# EAGLE design dual.seq.v1.0.0.main (EAGLE 7.7.0)
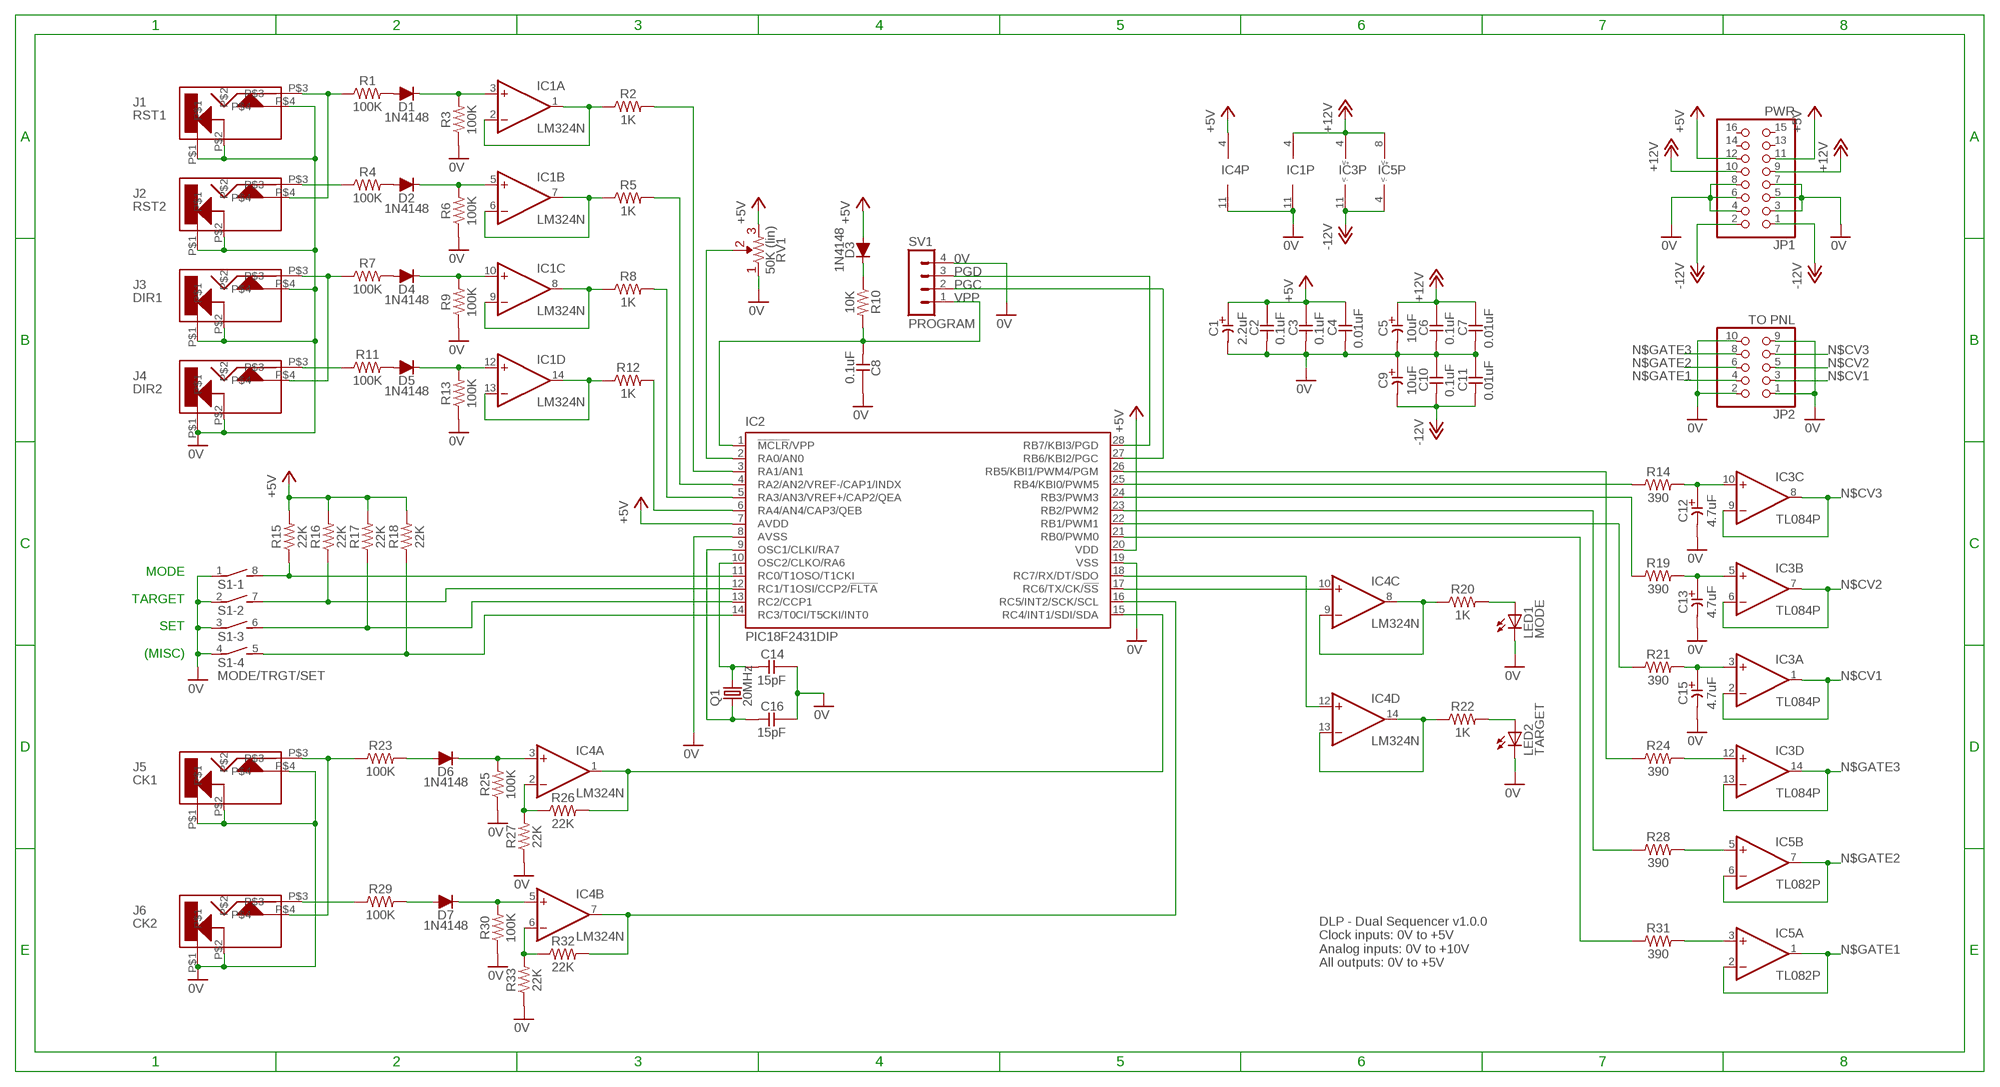
[diagram p0: schematic, sheet 1]

## Parts
C1  2.2uF  CE-USE2-5  [E2-5]
C2  0.1uF  CC-US025-024X044  [C025-024X044]
C3  0.1uF  CC-US025-024X044  [C025-024X044]
C4  0.01uF  CC-US025-024X044  [C025-024X044]
C5  10uF  CE-USE2-5  [E2-5]
C6  0.1uF  CC-US025-024X044  [C025-024X044]
C7  0.01uF  CC-US025-024X044  [C025-024X044]
C8  0.1uF  CC-US025-024X044  [C025-024X044]
C9  10uF  CE-USE2-5  [E2-5]
C10  0.1uF  CC-US025-024X044  [C025-024X044]
C11  0.01uF  CC-US025-024X044  [C025-024X044]
C12  4.7uF  CE-USE2-5  [E2-5]
C13  4.7uF  CE-USE2-5  [E2-5]
C14  15pF  CC-US025-024X044  [C025-024X044]
C15  4.7uF  CE-USE2-5  [E2-5]
C16  15pF  CC-US025-024X044  [C025-024X044]
D1  1N4148  [DO34-5]
D2  1N4148  [DO34-5]
D3  1N4148  [DO34-5]
D4  1N4148  [DO34-5]
D5  1N4148  [DO34-5]
D6  1N4148  [DO34-5]
D7  1N4148  [DO34-5]
IC1  LM324N  [DIL14]
IC2  PIC18F2431DIP  [DIL28-3]
IC3  TL084P  [DIL14]
IC4  LM324N  [DIL14]
IC5  TL082P  [DIL08]
J1  RST1  CL1384  [CL1384]
J2  RST2  CL1384  [CL1384]
J3  DIR1  CL1384  [CL1384]
J4  DIR2  CL1384  [CL1384]
J5  CK1  CL1384  [CL1384]
J6  CK2  CL1384  [CL1384]
JP1  PWR  PINHD-2X8  [2X08]
JP2  TO PNL  PINHD-2X5  [2X05]
LED1  MODE  LED3MM  [LED3MM]
LED2  TARGET  LED3MM  [LED3MM]
Q1  20MHz  CRYSTALHC49S  [HC49/S]
R1  100K  R  [0207/7]
R2  1K  R  [0207/7]
R3  100K  R  [0207/7]
R4  100K  R  [0207/7]
R5  1K  R  [0207/7]
R6  100K  R  [0207/7]
R7  100K  R  [0207/7]
R8  1K  R  [0207/7]
R9  100K  R  [0207/7]
R10  10K  R  [0207/7]
R11  100K  R  [0207/7]
R12  1K  R  [0207/7]
R13  100K  R  [0207/7]
R14  390  R  [0207/7]
R15  22K  R  [0207/7]
R16  22K  R  [0207/7]
R17  22K  R  [0207/7]
R18  22K  R  [0207/7]
R19  390  R  [0207/7]
R20  1K  R  [0207/7]
R21  390  R  [0207/7]
R22  1K  R  [0207/7]
R23  100K  R  [0207/7]
R24  390  R  [0207/7]
R25  100K  R  [0207/7]
R26  22K  R  [0207/7]
R27  22K  R  [0207/7]
R28  390  R  [0207/7]
R29  100K  R  [0207/7]
R30  100K  R  [0207/7]
R31  390  R  [0207/7]
R32  22K  R  [0207/7]
R33  22K  R  [0207/7]
RV1  50K (lin)  R-VAR  [R-VAR]
S1  MODE/TRGT/SET  DIP04S  [DIP04S]
SV1  PROGRAM  MA04-1  [MA04-1]

## Nets
0V: C1.- C2.2 C3.2 C4.2 C5.- C6.2 C7.2 C8.1 C9.+ C10.1 C11.1 C12.- C13.- C14.1 C15.- C16.1 IC1.11(P:V-) IC2.8(AVSS) IC2.19(VSS) IC4.11(P:V-) J1.P$1 J1.P$2 J1.P$4 J2.P$1 J2.P$2 J3.P$1 J3.P$2 J3.P$4 J4.P$1 J4.P$2 J5.P$1 J5.P$2 J5.P$4 J6.P$1 J6.P$2 JP1.3 JP1.4 JP1.5 JP1.6 JP1.7 JP1.8 JP2.1 JP2.2 JP2.9 JP2.10 LED1.K(C) LED2.K(C) R3.1 R6.1 R9.1 R13.1 R25.1 R27.1 R30.1 R33.1 RV1.R1 S1.1 S1.2 S1.3 S1.4 SV1.4
+5V: C1.+ C2.1 C3.1 C4.1 D3.A IC2.7(AVDD) IC2.20(VDD) IC4.4(P:V+) JP1.11 JP1.12 R15.2 R16.2 R17.2 R18.2 RV1.R2
+12V: C5.+ C6.1 C7.1 IC1.4(P:V+) IC3.4(P:V+) IC5.8(P:V+) JP1.9 JP1.10
-12V: C9.- C10.2 C11.2 IC3.11(P:V-) IC5.4(P:V-) JP1.1 JP1.2
CV3: C12.+ IC3.10(C:+IN) R14.2
N$1: D3.C R10.1
N$2: IC5.3(A:+IN) R31.2
N$3: IC5.5(B:+IN) R28.2
N$4: IC3.12(D:+IN) R24.2
N$5: C15.+ IC3.3(A:+IN) R21.2
N$6: C14.2 IC2.10(OSC2/CLKO/RA6) Q1.2
N$7: C13.+ IC3.5(B:+IN) R19.2
N$8: IC2.26(RB5/KBI1/PWM4/PGM) R24.1
N$9: IC2.23(RB2/PWM2) R28.1
N$10: IC2.21(RB0/PWM0) R31.1
N$11: D5.A R11.2
N$12: IC2.2(RA0/AN0) RV1.VAR
N$13: J1.P$3 J2.P$4 R1.1
N$14: IC2.3(RA1/AN1) R2.2
N$15: D2.A R4.2
N$16: IC2.25(RB4/KBI0/PWM5) R14.1
N$17: IC2.24(RB3/PWM3) R19.1
N$18: IC2.22(RB1/PWM1) R21.1
N$19: IC2.15(RC4/INT1/SDI/SDA) IC4.1(A:OUT) R26.2
N$20: IC2.11(RC0/T1OSO/T1CKI) R15.1 S1.8
N$21: IC2.16(RC5/INT2/SCK/SCL) IC4.7(B:OUT) R32.2
N$22: D5.C IC1.12(D:+IN) R13.2
N$23: J3.P$3 J4.P$4 R7.1
N$24: D4.C IC1.10(C:+IN) R9.2
N$25: IC2.4(RA2/AN2/VREF-/CAP1/INDX) R5.2
N$26: IC2.5(RA3/AN3/VREF+/CAP2/QEA) R8.2
N$27: C16.2 IC2.9(OSC1/CLKI/RA7) Q1.1
N$28: IC2.12(RC1/T1OSI/CCP2/!FLTA) R16.1 S1.7
N$29: IC2.13(RC2/CCP1) R17.1 S1.6
N$30: J5.P$3 J6.P$4 R23.1
N$31: IC2.6(RA4/AN4/CAP3/QEB) R12.2
N$32: D6.C IC4.3(A:+IN) R25.2
N$33: D2.C IC1.5(B:+IN) R6.2
N$34: IC4.13(D:-IN) IC4.14(D:OUT) R22.1
N$35: IC4.8(C:OUT) IC4.9(C:-IN) R20.1
N$36: IC2.17(RC6/TX/CK/!SS) IC4.10(C:+IN)
N$37: IC2.18(RC7/RX/DT/SDO) IC4.12(D:+IN)
N$38: LED1.A R20.2
N$39: LED2.A R22.2
N$40: D1.C IC1.3(A:+IN) R3.2
N$41: J6.P$3 R29.1
N$42: D7.C IC4.5(B:+IN) R30.2
N$43: IC2.14(RC3/T0CI/T5CKI/INT0) R18.1 S1.5
N$44: D6.A R23.2
N$45: D7.A R29.2
N$46: D4.A R7.2
N$47: D1.A R1.2
N$48: J4.P$3 R11.1
N$49: J2.P$3 R4.1
N$50: IC1.1(A:OUT) IC1.2(A:-IN) R2.1
N$51: IC1.6(B:-IN) IC1.7(B:OUT) R5.1
N$52: IC1.8(C:OUT) IC1.9(C:-IN) R8.1
N$53: IC1.13(D:-IN) IC1.14(D:OUT) R12.1
N$54: IC4.2(A:-IN) R26.1 R27.2
N$55: IC4.6(B:-IN) R32.1 R33.2
N$CV1: IC3.1(A:OUT) IC3.2(A:-IN) JP2.3
N$CV2: IC3.6(B:-IN) IC3.7(B:OUT) JP2.5
N$CV3: IC3.8(C:OUT) IC3.9(C:-IN) JP2.7
N$GATE1: IC5.1(A:OUT) IC5.2(A:-IN) JP2.4
N$GATE2: IC5.6(B:-IN) IC5.7(B:OUT) JP2.6
N$GATE3: IC3.13(D:-IN) IC3.14(D:OUT) JP2.8
PGC: IC2.27(RB6/KBI2/PGC) SV1.2
PGD: IC2.28(RB7/KBI3/PGD) SV1.3
VPP: C8.2 IC2.1(!MCLR!/VPP) R10.2 SV1.1
Unconnected: JP1.13 JP1.14 JP1.15 JP1.16

## Notes on the sheet
- MODE
  
  TARGET
  
  SET
  
  (MISC)
- DLP - Dual Sequencer v1.0.0
  Clock inputs: 0V to +5V
  Analog inputs: 0V to +10V
  All outputs: 0V to +5V

## Library data of the parts
C1 C5 C9 C12 C13 C15 = _common:CE-US: ELECTROLYTIC CAPACITOR, US symbol
C2-C4 C6-C8 C10 C11 C14 C16 = _common:CC-US: CAPACITOR, US symbol
D1-D7 = _common:1N4148: DIODE high speed (Philips)
IC1 IC4 = linear:LM324: OP AMP
IC2 = _common:PIC18F2*31: USB Microcontrollers with nanoWatt Technology High-Performance, Enhanced Flash, 28-Pin, Source: http://ww1.microchip.com/downloads/en/devicedoc/39616d.pdf; MF: MICROCHIP; MPN: PIC18F2431-I/SP
IC3 = _common:TL084: OP AMP
IC5 = _common:TL082: OP AMP
J1-J6 = jacks:CL1384
JP1 = pinhead:PINHD-2X8: PIN HEADER
JP2 = pinhead:PINHD-2X5: PIN HEADER
LED1 LED2 = led:LED: LED OSRAM: - CHIPLED LG R971, LG N971, LY N971, LG Q971, LY Q971, LO R971, LY R971 LH N974, LH R974 LS Q976, LO Q976, LY Q976 LO Q996 - Hyper CHIPLED LW Q18S LB Q993, LB Q99A, LB R99A - SideLED LS A670, LO A670, LY A670, LG A670, LP A670 LB A673, LV A673, LT A673, LW A673 LH A674 LY A675 LS A676, LA A676, LO A676, LY A676, LW A676 LS A679, LY A679, LG A679 - Hyper Micro SIDELED® LS Y876, LA Y876, LO Y876, LY Y876 LT Y87S - SmartLED LW L88C, LW L88S LB L89C, LB L89S, LG L890 LS L89K, LO L89K, LY L89K LS L896, LA L896, LO L896, LY L896 - TOPLED LS T670, LO T670, LY T670, LG T670, LP T670 LSG T670, LSP T670, LSY T670, LOP T670, LYG T670 LG T671, LOG T671, LSG T671 LB T673, LV T673, LT T673, LW T673 LH T674 LS T676, LA T676, LO T676, LY T676, LB T676, LH T676, LSB T676, LW T676 LB T67C, LV T67C, LT T67C, LS T67K, LO T67K, LY T67K, LW E67C LS E67B, LA E67B, LO E67B, LY E67B, LB E67C, LV E67C, LT E67C LW T67C LS T679, LY T679, LG T679 LS T770, LO T770, LY T770, LG T770, LP T770 LB T773, LV T773, LT T773, LW T773 LH T774 LS E675, LA E675, LY E675, LS T675 LS T776, LA T776, LO T776, LY T776, LB T776 LHGB T686 LT T68C, LB T68C - Hyper Mini TOPLED® LB M676 - Mini TOPLED Santana® LG M470 LS M47K, LO M47K, LY M47K Source: http://www.osram.convergy.de LUXEON: - LUMILED® LXK2-PW12-R00, LXK2-PW12-S00, LXK2-PW14-U00, LXK2-PW14-V00 LXK2-PM12-R00, LXK2-PM12-S00, LXK2-PM14-U00 LXK2-PE12-Q00, LXK2-PE12-R00, LXK2-PE12-S00, LXK2-PE14-T00, LXK2-PE14-U00 LXK2-PB12-K00, LXK2-PB12-L00, LXK2-PB12-M00, LXK2-PB14-N00, LXK2-PB14-P00, LXK2-PB14-Q00 LXK2-PR12-L00, LXK2-PR12-M00, LXK2-PR14-Q00, LXK2-PR14-R00 LXK2-PD12-Q00, LXK2-PD12-R00, LXK2-PD12-S00 LXK2-PH12-R00, LXK2-PH12-S00 LXK2-PL12-P00, LXK2-PL12-Q00, LXK2-PL12-R00 Source: www.luxeon.com KINGBRIGHT: KA-3528ASYC Source: www.kingbright.com
Q1 = crystal:CRYSTAL: CRYSTAL; OC_FARNELL: 1667008; OC_NEWARK: unknown
R1-R33 = _common:R: RESISTOR, US symbol
RV1 = _common:R-VAR
S1 = switch-dil:DIP04S: DIL/CODE SWITCH; OC_FARNELL: unknown; OC_NEWARK: unknown
SV1 = con-lstb:MA04-1: PIN HEADER; OC_FARNELL: unknown; OC_NEWARK: unknown

## Board
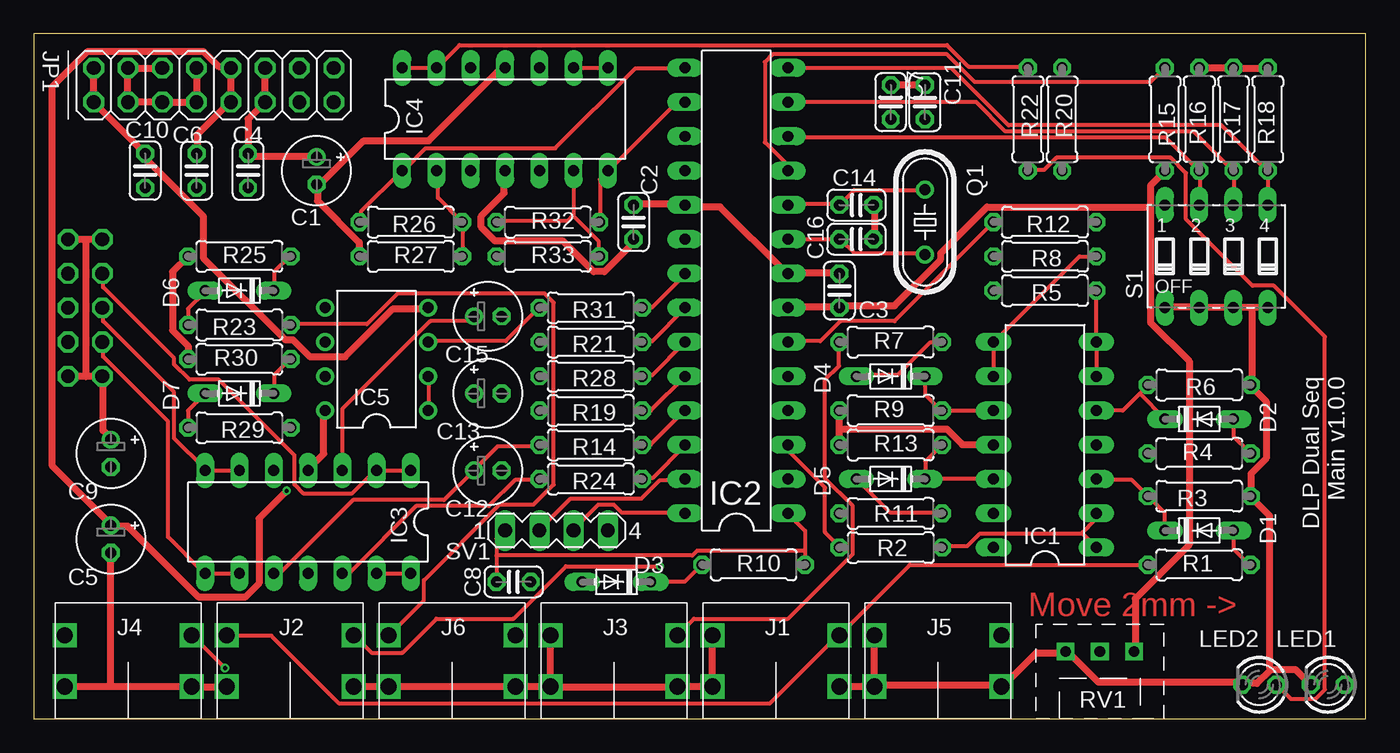
[diagram p1: board, top side]
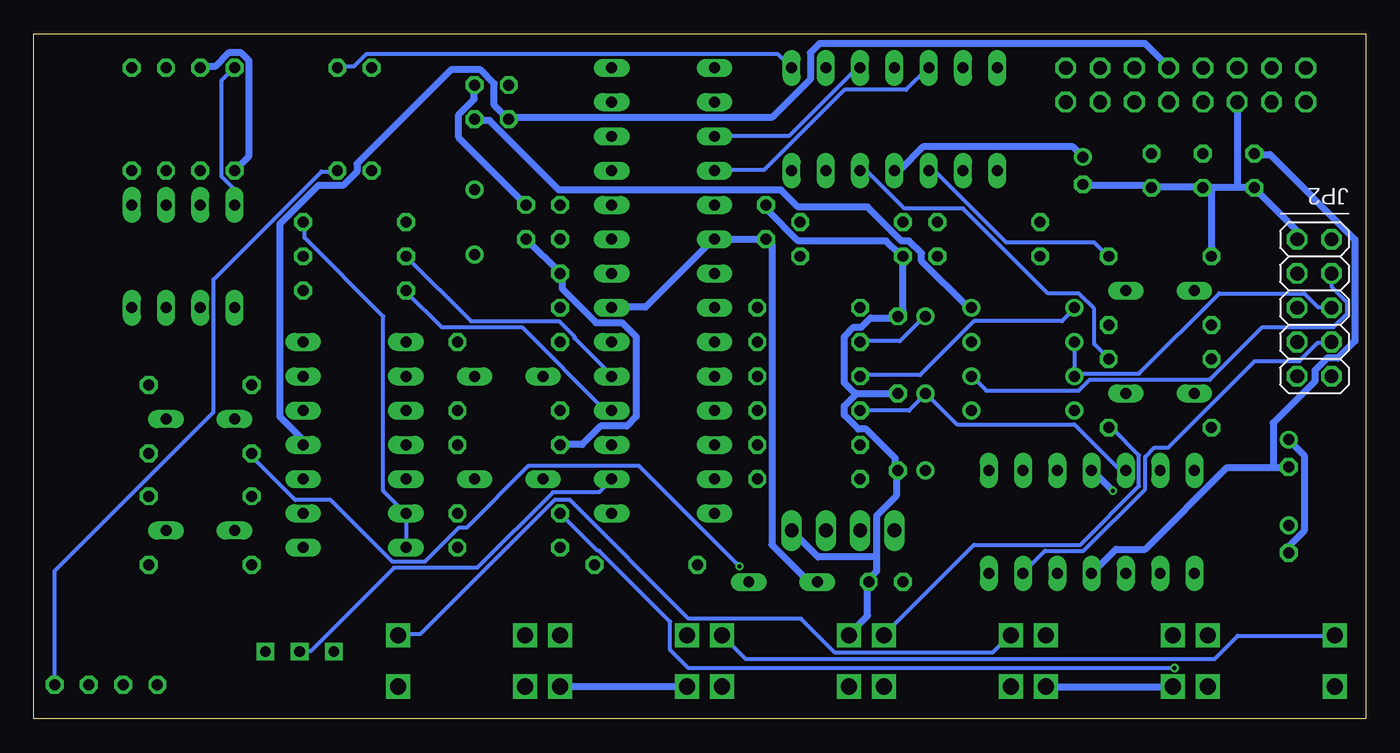
[diagram p2: board, bottom side, seen from below]

Size 98.7 x 50.79 mm. Coordinates in mm from the lower left corner, seen from the top.
Outline: 0,0 98.7,0 98.7,50.79 0,50.79 0,0
Copper layers (1*16): Top 0.035mm / dielectric 1.5mm / Bottom 0.035mm
Design rules "SeeedStudio_2layer_DRU_no_angle_20140221": minimum track width 6mil, minimum drill 12mil, track to track 6mil, track to pad 6mil, pad to pad 6mil, via to via 6mil, smd to smd 0mil, copper to edge 10mil, drill to drill 10mil, minimum pad ring 10mil, minimum via ring 6mil, stop-mask expansion 2mil, vias tented up to drill 100mil, thermal gap 10mil

### Footprints (pad centres in the part's own frame; a part is rotated, then mirrored left to right if it is on the bottom)
E2-5 = drill 0.813 pad 1.27: + -1.016,0 | drill 0.813 pad 1.27 octagon: - 1.016,0
C025-024X044 = drill 0.813 octagon: 1 -1.27,0; 2 1.27,0
DO34-5 = drill 0.813 long: A 2.54,0; C -2.54,0
DIL14 = drill 0.813 long: 1 -7.62,-3.81; 2 -5.08,-3.81; 3 -2.54,-3.81; 4 0,-3.81; 5 2.54,-3.81; 6 5.08,-3.81; 7 7.62,-3.81; 8 7.62,3.81; 9 5.08,3.81; 10 2.54,3.81; 11 0,3.81; 12 -2.54,3.81; 13 -5.08,3.81; 14 -7.62,3.81
DIL28-3 = drill 0.813 long: 1 -16.51,-3.81; 2 -13.97,-3.81; 3 -11.43,-3.81; 4 -8.89,-3.81; 5 -6.35,-3.81; 6 -3.81,-3.81; 7 -1.27,-3.81; 8 1.27,-3.81; 9 3.81,-3.81; 10 6.35,-3.81; 11 8.89,-3.81; 12 11.43,-3.81; 13 13.97,-3.81; 14 16.51,-3.81; 15 16.51,3.81; 16 13.97,3.81; 17 11.43,3.81; 18 8.89,3.81; 19 6.35,3.81; 20 3.81,3.81; 21 1.27,3.81; 22 -1.27,3.81; 23 -3.81,3.81; 24 -6.35,3.81; 25 -8.89,3.81; 26 -11.43,3.81; 27 -13.97,3.81; 28 -16.51,3.81
DIL08 = drill 0.813 pad 1.27: 1 -3.81,-3.81; 2 -1.27,-3.81; 3 1.27,-3.81; 4 3.81,-3.81; 5 3.81,3.81; 6 1.27,3.81; 7 -1.27,3.81; 8 -3.81,3.81
CL1384 = drill 1.2 square: P$1 0,0; P$2 9.4,0; P$3 0,-3.8; P$4 9.4,-3.8
2X08 = drill 1.016 octagon: 1 -8.89,-1.27; 2 -8.89,1.27; 3 -6.35,-1.27; 4 -6.35,1.27; 5 -3.81,-1.27; 6 -3.81,1.27; 7 -1.27,-1.27; 8 -1.27,1.27; 9 1.27,-1.27; 10 1.27,1.27; 11 3.81,-1.27; 12 3.81,1.27; 13 6.35,-1.27; 14 6.35,1.27; 15 8.89,-1.27; 16 8.89,1.27
2X05 = drill 1.016 octagon: 1 -5.08,-1.27; 2 -5.08,1.27; 3 -2.54,-1.27; 4 -2.54,1.27; 5 0,-1.27; 6 0,1.27; 7 2.54,-1.27; 8 2.54,1.27; 9 5.08,-1.27; 10 5.08,1.27
LED3MM = drill 0.813 octagon: A -1.27,0; K 1.27,0
HC49/S = drill 0.813: 1 -2.413,0; 2 2.413,0
0207/7 = drill 0.813 octagon: 1 -3.81,0; 2 3.81,0
R-VAR = drill 0.8 square: R1 -2.54,0; R2 2.54,0; VAR 0,0
DIP04S = drill 0.813 long: 1 -3.81,-3.81; 2 -1.27,-3.81; 3 1.27,-3.81; 4 3.81,-3.81; 5 3.81,3.81; 6 1.27,3.81; 7 -1.27,3.81; 8 -3.81,3.81
MA04-1 = drill 1.016 long: 1 -3.81,0; 2 -1.27,0; 3 1.27,0; 4 3.81,0

### Placement (x,y rotation side)
C1  20.95,40.64 270 top
C2  44.45,36.83 90 top
C3  59.69,31.75 90 top
C4  15.88,40.64 270 top
C5  5.71,13.34 270 top
C6  12.06,40.64 270 top
C7  63.5,45.72 90 top
C8  35.56,10.16 180 top
C9  5.71,19.68 270 top
C10  8.26,40.64 90 top
C11  66.04,45.72 270 top
C12  33.66,18.41 0 top
C13  33.66,24.13 0 top
C14  60.96,38.1 180 top
C15  33.66,29.84 0 top
C16  60.96,35.56 180 top
D1  86.36,13.97 0 top
D2  86.36,22.23 0 top
D3  43.18,10.16 180 top
D4  63.5,25.4 180 top
D5  63.5,17.78 180 top
D6  15.24,31.75 180 top
D7  15.24,24.13 180 top
IC1  74.93,20.32 90 top
IC2  52.07,31.75 90 top
IC3  20.32,14.61 180 top
IC4  34.92,44.45 0 top
IC5  25.4,26.67 90 top
J1  59.7,2.4 180 top
J2  23.7,2.4 180 top
J3  47.7,2.4 180 top
J4  11.7,2.4 180 top
J5  71.7,2.4 180 top
J6  35.7,2.4 180 top
JP1  13.34,46.99 0 top
JP2  3.81,30.48 270 bottom
LED1  95.89,2.54 180 top
LED2  90.81,2.54 180 top
Q1  66.04,36.83 90 top
R1  86.36,11.43 0 top
R2  63.5,12.7 180 top
R3  86.36,16.51 180 top
R4  86.36,19.68 0 top
R5  74.93,31.75 180 top
R6  86.36,24.77 180 top
R7  63.5,27.94 0 top
R8  74.93,34.29 180 top
R9  63.5,22.86 0 top
R10  53.34,11.43 0 top
R11  63.5,15.24 0 top
R12  74.93,36.83 180 top
R13  63.5,20.32 0 top
R14  41.27,20.32 180 top
R15  83.82,44.45 270 top
R16  86.36,44.45 90 top
R17  88.9,44.45 90 top
R18  91.44,44.45 90 top
R19  41.27,22.86 180 top
R20  76.2,44.45 270 top
R21  41.27,27.94 180 top
R22  73.66,44.45 270 top
R23  15.24,29.21 180 top
R24  41.27,17.78 180 top
R25  15.24,34.29 0 top
R26  27.94,36.83 180 top
R27  27.94,34.29 0 top
R28  41.27,25.4 180 top
R29  15.24,21.59 180 top
R30  15.24,26.67 0 top
R31  41.27,30.48 180 top
R32  38.1,36.83 0 top
R33  38.1,34.29 0 top
RV1  79,5 0 top
S1  87.63,34.29 0 top
SV1  38.73,13.97 0 top

### Tracks (layer width: path | path; a pad name or v marks a point on that pad's centre or on a via)
0V
  Top 0.508: R27.1 24.12,34.29 24.12,35.32 21.03,38.41 21.03,39.55 C1.- 21.26,39.66 24.46,42.86 29.26,42.86 34.63,48.23 34.86,48.23 IC4.11 | JP1.6 9.49,48.23 7.2,48.23 JP1.4 6.97,48.23 6.97,45.95 JP1.3 JP1.5 JP1.7 12.12,45.95 12.12,48.23 JP1.8 | R30.1 11.43,27.66 10.29,28.8 10.29,33.15 R25.1 | 3.89,35.55 5.03,35.55 JP2.1 | 3.89,35.55 2.63,35.55 JP2.2 | 59.66,21.49 59.66,22.86 R9.1 | 59.66,21.49 59.66,20.34 R13.1 | 59.66,21.49 67.67,21.49 68.81,20.34 71.09,20.34 IC1.11 | C2.2 44.46,38.18 48.23,38.18 IC2.19 48.46,37.95 50.86,37.95 55.66,33.15 IC2.8 55.89,33.03 59.66,33.03 C3.2 | C7.2 63.55,46.98 65.95,46.98 C11.1 | C16.1 62.29,35.66 62.29,38.06 C14.1 | S1.1 83.9,30.52 86.3,30.52 S1.2 86.53,30.52 88.81,30.52 S1.3 89.15,30.52 90.3,30.52 | 90.3,30.52 91.44,30.52 S1.4 | 91.67,3.66 90.64,2.63 89.61,2.63 LED2.K 89.38,2.74 78.87,2.74 76.69,4.92 RV1.R1 76.35,4.92 74.3,4.92 71.78,2.4 J5.P$1 71.55,2.52 62.52,2.52 J5.P$2 | 91.67,3.66 93.5,3.66 LED1.K | 91.67,3.66 91.55,3.89 91.55,15.09 90.3,16.34 R3.1 90.18,16.57 90.18,18.17 91.33,19.32 91.33,23.55 90.18,24.69 R6.1 90.3,24.92 90.3,30.52 | J1.P$1 59.78,2.4 J5.P$2 | J5.P$4 62.29,6.17 62.29,2.63 J5.P$2 | 3.89,25.38 5.03,25.38 JP2.9 5.14,25.15 5.14,21.37 5.71,20.8 C9.+ | 3.89,25.38 2.63,25.38 JP2.10 | 5.71,2.4 11.66,2.4 J4.P$1 11.89,2.4 14.29,2.4 J2.P$2 | 5.71,2.4 2.4,2.4 J4.P$2 | J1.P$4 50.29,6.17 50.29,2.63 J1.P$2 47.78,2.4 J3.P$1 47.55,2.4 38.52,2.4 J3.P$2 | J2.P$1 23.77,2.4 J6.P$2 26.52,2.4 35.55,2.4 J6.P$1 35.78,2.4 J3.P$2 | 5.71,2.4 C5.- | J3.P$4 38.29,6.17 38.29,2.63 J3.P$2 | 3.89,25.38 3.89,35.55
  Bottom 0.508: 9.49,39.43 12,39.43 C6.2 | 9.49,39.43 8.34,39.43 C10.1 8.12,39.2 5.14,36.23 5.14,35.66 JP2.1 | C6.2 12.23,39.43 15.77,39.43 C4.2 16,39.55 20.92,39.55 C1.- | R25.1 11.43,39.2 C6.2 | 9.49,39.43 9.49,45.72 JP1.5 | C16.1 62.18,35.55 59.66,33.03 C3.2 59.55,32.8 59.55,31.89 57.04,29.38 55.09,29.38 54.06,28.35 54.06,22.4 54.75,21.72 56.69,21.72 58.06,20.34 59.66,20.34 R13.1 | C11.1 66.06,46.98 66.06,45.95 67.21,44.81 67.21,43.09 62.29,38.18 C14.1 | J3.P$4 38.29,6.29 36.92,7.66 36.92,10.06 C8.1 36.8,10.4 36.23,10.97 36.23,12 | 36.23,12 36.23,15.09 34.75,16.57 34.75,18.4 C12.- 34.86,18.63 34.86,19.32 37.03,21.49 37.6,21.49 38.63,22.52 38.63,23.2 37.72,24.12 | 37.72,24.12 34.75,24.12 C13.- | SV1.4 40.58,12 36.23,12 | 37.72,24.12 37.95,24.23 38.63,24.92 38.63,28.35 37.95,29.03 37.38,29.03 36.69,29.72 34.86,29.72 C15.- 34.63,29.95 34.29,30.29 R33.1 34.52,34.4 35.55,35.43 42.06,35.43 44.35,37.72 44.35,38.06 C2.2 | C5.- 5.71,12.8 4.57,13.95 4.57,19.55 5.71,20.69 C9.+ | J2.P$2 14.4,2.4 23.66,2.4 J2.P$1 | J1.P$1 59.66,2.4 50.41,2.4 J1.P$2
+5V
  Top 0.508: R16.2 86.41,48.23 88.81,48.23 R17.2 89.15,48.23 91.44,48.23 R18.2 | 82.75,37.95 82.75,39.55 83.78,40.58 R15.2 | 82.75,37.95 82.75,29.38 85.61,26.52 85.61,12.92 81.61,8.91 81.61,5.03 RV1.R2 | C1.+ 20.92,41.72 16,41.72 C4.1 15.89,41.95 15.89,44.46 JP1.11 JP1.12 | IC2.7 55.89,30.52 59.66,30.52 C3.1 59.89,30.63 63.78,30.63 67.21,34.06 67.21,34.52 70.64,37.95 82.75,37.95 | IC4.4 34.86,40.58 34.86,38.98 33.15,37.26 33.15,36.46 34.18,35.43 39.2,35.43 41.49,33.15 42.29,33.15 44.35,35.2 44.35,35.55 C2.1
  Bottom 0.508: R16.2 86.3,48.35 85.27,48.35 84.24,49.38 83.33,49.38 82.75,48.81 82.75,41.72 83.78,40.69 R15.2 | IC4.4 34.86,40.69 34.52,40.69 32.8,42.41 21.72,42.41 21.03,41.72 C1.+ | D3.A 40.69,10.17 41.26,10.17 44.01,12.92 44.01,35.2 44.35,35.55 C2.1 44.69,35.55 48.23,35.55 IC2.20 48.46,35.43 53.38,30.52 55.78,30.52 IC2.7
+12V  (via drill 0.3)
  Top 0.508: C6.1 12.12,41.95 12.12,43.32 14.52,45.72 JP1.9 14.63,45.95 14.63,48.23 JP1.10 14.4,48.35 13.72,48.35 12.57,49.49 4,49.49 1.37,46.86 1.37,18.75 5.6,14.52 C5.+ 5.71,14.29 6.97,14.29 12.23,9.03 15.66,9.03 16.69,10.06 16.69,14.86 v18.75,16.92 | IC5.8 21.49,22.86 21.49,19.66 20.34,18.52 IC3.4
  Bottom 0.508: IC1.4 78.75,20.34 78.75,20.69 80.47,22.4 80.47,36.69 77.61,39.55 75.78,39.55 74.75,40.58 74.75,41.15 67.78,48.12 65.61,48.12 64.58,47.09 64.58,45.49 63.55,44.46 C7.1 63.32,44.58 44.01,44.58 41.15,47.43 41.15,49.38 40.46,50.06 16.34,50.06 14.63,48.35 JP1.10 | v18.75,16.92 20.23,18.4 IC3.4
-12V
  Top 0.508: IC5.4 29.15,30.4 26.63,30.4 23.09,26.86 20.46,26.86 19.2,28.12 18.63,28.12 12.57,34.18 12.57,37.26 8.12,41.72 C10.2 8.23,41.95 JP1.1 4.46,45.95 4.46,48.23 JP1.2
  Bottom 0.508: 6.86,18.63 10.29,18.63 16.34,12.57 18.52,12.57 20.23,10.86 IC3.11 | 6.86,18.63 5.71,18.63 C9.- | C11.2 65.95,44.35 64.92,44.35 59.78,39.2 43.32,39.2 42.06,37.95 36.92,37.95 34.4,35.43 33.83,35.43 32.92,34.52 32.92,33.95 29.49,30.52 29.26,30.52 IC5.4 | 6.86,18.63 6.86,21.95 3.77,25.03 3.77,25.83 2.86,26.75 2.06,26.75 0.8,28 0.8,35.55 7.09,41.83 8.23,41.83 C10.2
CV3
  Top 0.305: IC3.10 17.83,10.86 18.29,10.86 23.66,16.23 30.4,16.23 32.58,18.4 C12.+ 32.69,18.52 34.4,20.23 37.38,20.23 R14.2
N$1
  Top 0.305: D3.C 45.72,10.17 48.23,10.17 49.49,11.43 R10.1
N$2
  Top 0.305: IC5.3 29.26,28 34.98,28 37.38,30.4 R31.2
N$3
  Bottom 0.305: R28.2 37.38,25.49 33.03,25.49 29.03,29.49 22.52,29.49 21.6,30.4 IC5.5
N$4
  Top 0.305: IC3.12 22.86,10.86 23.43,10.86 28.35,15.77 33.72,15.77 35.66,17.72 37.38,17.72 R24.2
N$5
  Top 0.305: IC3.3 22.86,22.97 29.38,29.49 32.23,29.49 32.58,29.83 C15.+
  Bottom 0.305: R21.2 37.38,28 34.52,28 32.69,29.83 C15.+
N$6
  Top 0.305: IC2.10 55.89,38.18 59.66,38.18 C14.2 59.78,38.18 60.81,39.2 65.95,39.2 Q1.2
N$7
  Bottom 0.305: IC3.5 17.83,18.52 18.29,18.52 21.6,21.83 30.29,21.83 32.58,24.12 C13.+ 32.69,24 33.83,22.86 R19.2
N$8
  Top 0.305: R24.1 45.15,17.83 45.83,17.83 48.23,20.23 IC2.26
N$9
  Top 0.305: R28.1 45.15,25.49 45.83,25.49 48.23,27.89 IC2.23
N$10
  Top 0.305: R31.1 45.15,30.52 45.83,30.52 48.23,32.92 IC2.21
N$11
  Top 0.305: R11.2 67.21,15.32 63.44,15.32 61.04,17.72 D5.A
N$12
  Bottom 0.305: RV1.VAR 78.98,5.03 78.18,5.03 72.01,11.2 65.84,11.2 60.24,16.8 56.81,16.8 55.89,17.72 IC2.2
N$13
  Top 0.305: R1.1 64.92,11.43 59.78,6.29 J1.P$3 59.55,6.17 54.52,1.14 22.63,1.14 17.6,6.17 14.4,6.17 J2.P$4
N$14
  Top 0.305: IC2.3 55.89,20.23 55.89,19.89 58.64,17.14 58.64,13.83 59.66,12.8 R2.2
N$15
  Top 0.305: D2.A 88.92,22.17 88.92,20.92 90.07,19.77 R4.2
N$16
  Top 0.305: R14.1 45.15,20.34 45.72,20.34 48.23,22.86 IC2.25
N$17
  Top 0.305: R19.1 45.72,22.86 IC2.24
N$18
  Top 0.305: R21.1 45.15,28 45.83,28 48.23,30.4 IC2.22
N$19
  Top 0.305: R26.2 24.23,36.92 24.23,37.6 27.2,40.58 IC4.1 27.43,40.69 29.03,42.29 38.63,42.29 44.58,48.23 48.23,48.23 IC2.15
N$20
  Top 0.305: IC2.11 55.78,40.69 55.78,41.15 54.18,42.75 54.18,48.69 54.75,49.26 67.67,49.26 69.72,47.21 82.75,47.21 83.78,48.23 R15.1
  Bottom 0.305: S1.8 83.9,38.18 83.9,39.32 84.81,40.23 84.81,47.32 83.9,48.23 R15.1
N$21
  Top 0.305: R32.2 41.95,36.92 41.95,40.01 42.52,40.58 IC4.7 42.63,40.69 47.66,45.72 IC2.16
N$22
  Top 0.305: R13.2 67.21,20.23 66.06,19.09 66.06,17.83 D5.C 66.18,17.83 71.09,17.83 IC1.12
N$23
  Top 0.305: R7.1 59.66,27.89 59.66,26.18 58.64,25.15 58.64,17.83 60.69,15.77 60.69,12.23 55.89,7.43 48.92,7.43 47.78,6.29 J3.P$3
  Bottom 0.305: J4.P$4 2.4,6.17 9.49,6.17 11.2,4.46 45.95,4.46 47.66,6.17 J3.P$3
N$24
  Top 0.305: D4.C 66.06,25.38 66.06,24 67.21,22.86 R9.2 IC1.10
N$25
  Bottom 0.305: IC2.4 56.35,22.86 62.52,29.03 68.47,29.03 71.09,31.66 R5.2
N$26
  Bottom 0.305: IC2.5 55.89,25.49 58.64,28.23 58.64,28.35 59.78,29.49 66.29,29.49 71.09,34.29 R8.2
N$27
  Top 0.305: IC2.9 55.89,35.55 59.66,35.55 C16.2 59.78,35.55 60.81,34.52 65.95,34.52 Q1.1
N$28
  Top 0.305: S1.7 86.41,38.18 86.41,40.58 R16.1 86.3,40.69 83.9,43.09 55.89,43.09 IC2.12
N$29
  Top 0.305: S1.6 88.92,38.18 88.92,40.58 R17.1 88.81,40.69 85.95,43.55 72.01,43.55 69.84,45.72 IC2.13
N$30
  Top 0.305: R23.1 19.09,29.26 24.69,29.26 26.98,31.55 37.83,31.55 38.52,30.86 38.52,17.37 37.03,15.89 34.52,15.89 28.92,10.29 28.92,8.8 26.4,6.29 J6.P$4
  Bottom 0.305: J5.P$3 71.67,6.29 70.07,6.29 60.12,16.23 58.98,16.23 50.18,7.43 41.83,7.43 39.32,4.92 27.66,4.92 26.4,6.17 J6.P$4
N$31
  Top 0.305: R12.2 63.78,29.49 59.78,29.49 58.29,28 55.89,28 IC2.6
N$32
  Top 0.305: D6.C 17.83,31.77 17.83,33.15 18.97,34.29 R25.2
  Bottom 0.305: IC4.3 32.35,40.58 31.89,40.58 26.63,35.32 20.12,35.32 19.09,34.29 R25.2
N$33
  Top 0.305: IC1.5 80.7,22.86 81.95,24.12 | 81.95,24.12 82.53,24.69 R6.2 | 81.95,24.12 83.78,22.29 D2.C
N$34
  Top 0.305: IC4.14 27.32,48.23 29.83,48.23 IC4.13 29.95,48.35 31.55,49.95 67.67,49.95 69.27,48.35 73.61,48.35 R22.1
N$35
  Top 0.305: IC4.9 40.01,48.23 42.52,48.23 IC4.8
  Bottom 0.305: IC4.8 43.55,49.26 74.07,49.26 74.98,48.35 76.12,48.35 R20.1
N$36
  Bottom 0.305: IC2.17 48.23,43.2 42.75,43.2 37.72,48.23 37.49,48.23 IC4.10
N$37
  Bottom 0.305: IC2.18 48.23,40.69 44.58,40.69 38.63,46.63 34.06,46.63 32.46,48.23 IC4.12
N$38
  Bottom 0.305: LED1.A 97.16,10.97 85.38,22.75 85.38,32.58 77.38,40.58 76.24,40.58 R20.2
N$39
  Top 0.305: R22.2 73.72,40.69 74.87,40.69 75.78,41.6 84.24,41.6 85.38,40.46 85.38,37.03 90.3,32.12 91.9,32.12 95.67,28.35 95.67,2.17 94.98,1.49 93.15,1.49 92.13,2.52 LED2.A
N$40
  Top 0.305: IC1.3 78.75,17.72 81.38,17.72 82.53,16.57 R3.2 82.64,16.46 83.78,15.32 83.78,14.06 D1.C
N$41
  Bottom 0.305: R29.1 18.97,21.49 18.75,21.49 16.8,19.55 16.8,17.26 21.14,12.92 29.03,12.92 35.66,6.29 J6.P$3
N$42
  Top 0.305: D7.C 17.83,24.23 17.83,25.49 18.97,26.63 R30.2
  Bottom 0.305: IC4.5 37.38,40.58 36.92,40.58 34.18,37.83 29.83,37.83 23.55,31.55 21.26,31.55 20.12,30.4 20.12,27.77 19.09,26.75 R30.2
N$43
  Top 0.305: S1.5 R18.1 91.33,40.69 88.01,44.01 72.24,44.01 68.01,48.23 55.89,48.23 IC2.14
N$44
  Top 0.305: R23.2 11.43,30.4 12.69,31.66 D6.A
N$45
  Top 0.305: R29.2 11.43,22.86 D7.A
N$46
  Top 0.305: D4.A 61.04,25.49 64.01,25.49 66.41,27.89 67.21,27.89 R7.2
N$47
  Top 0.305: D1.A 88.92,13.95 88.92,12.57 90.07,11.43 R1.2
N$48  (via drill 0.3)
  Top 0.305: v14.17,3.77 11.77,6.17 J4.P$3
  Bottom 0.305: v14.17,3.77 50.18,3.77 51.55,5.14 51.55,7.2 56.81,12.46 56.92,12.46 59.66,15.2 R11.1
N$49  (via drill 0.3)
  Top 0.305: v46.41,11.32 39.43,11.32 35.55,7.43 29.83,7.43 27.32,4.92 25.03,4.92 23.77,6.17 J2.P$3
  Bottom 0.305: v46.41,11.32 53.84,18.75 62.06,18.75 66.64,14.17 67.21,14.17 69.72,11.66 72.12,11.66 76.69,16.23 79.32,16.23 82.53,19.43 82.53,19.66 R4.1
N$50
  Top 0.305: 77.72,13.72 70.07,13.72 69.15,12.8 67.32,12.8 R2.1 | IC1.1 77.72,13.72 | IC1.2 78.64,15.2 78.64,14.74 77.72,13.83 77.72,13.72
N$51
  Top 0.305: IC1.6 78.75,25.49 78.75,27.89 IC1.7 78.75,28 78.75,31.66 R5.1
N$52
  Top 0.305: IC1.9 71.09,25.49 71.09,27.89 IC1.8 71.21,28 77.5,34.29 R8.1
N$53
  Bottom 0.305: IC1.14 71.09,12.8 71.09,15.2 IC1.13 71.21,15.32 72.81,16.92 72.81,29.83 78.64,35.66 78.64,36.8 R12.1
N$54
  Top 0.305: R27.2 31.77,34.29 31.77,36.8 R26.1 29.95,38.63 29.95,40.58 IC4.2
N$55
  Top 0.305: 40.01,37.26 41.83,35.43 41.83,34.29 R33.2 | IC4.6 40.01,37.26 | R32.1 34.29,36.92 39.55,36.92 39.89,37.26 40.01,37.26
N$CV1
  Top 0.305: IC3.1 27.89,18.4 25.49,18.4 IC3.2 25.26,18.4 23.55,16.69 20,16.69 19.32,17.37 19.32,19.55 13.72,25.15 11.54,25.15 10.4,26.29 10.4,26.75 5.14,32 5.14,32.92 JP2.3
N$CV2
  Top 0.305: IC3.6 15.2,18.4 12.8,18.4 IC3.7 12.69,18.52 10.4,20.8 10.4,24.23 5.14,29.49 5.14,30.4 JP2.5
N$CV3
  Top 0.305: IC3.9 15.2,10.74 12.8,10.74 IC3.8 12.57,10.86 9.94,13.49 9.94,22.06 5.14,26.86 5.14,27.89 JP2.7
N$GATE1
  Top 0.305: IC5.1 29.26,22.86 29.26,25.38 IC5.2
  Bottom 0.305: JP2.4 2.52,32.92 2.52,32 1.37,30.86 1.37,30.06 2.4,29.03 7.66,29.03 11.54,25.15 20.46,25.15 21.26,24.35 28.12,24.35 29.15,25.38 IC5.2
N$GATE2
  Bottom 0.305: IC5.6 21.6,27.89 21.6,25.49 IC5.7 21.49,25.6 16.8,25.6 10.86,31.55 4.57,31.55 3.54,30.52 2.63,30.52 JP2.6
N$GATE3
  Top 0.305: IC3.13 25.49,10.74 27.89,10.74 IC3.14
  Bottom 0.305: JP2.8 2.63,27.89 3.54,27.89 4.92,26.52 8.23,26.52 14.63,20.12 15.66,20.12 16.34,19.43 16.34,17.03 20.92,12.46 23.77,12.46 25.38,10.86 IC3.13
PGC
  Top 0.305: IC2.27 48.23,17.72 46.41,17.72 45.03,16.34 39.78,16.34 37.49,14.06 SV1.2
PGD
  Top 0.305: IC2.28 48.23,15.32 43.55,15.32 42.98,15.89 41.83,15.89 40.01,14.06 SV1.3
VPP
  Top 0.305: 34.29,12.12 34.29,13.37 34.86,13.95 SV1.1 | 34.29,12.12 C8.2 | 57.15,12.46 57.15,13.95 55.89,15.2 IC2.1 | 57.15,12.46 R10.2 | 34.29,12.12 48.81,12.12 49.15,12.46 57.15,12.46

### Text on the board
Top: Move 2mm ->
tNames: DLP Dual Seq / Main v1.0.0